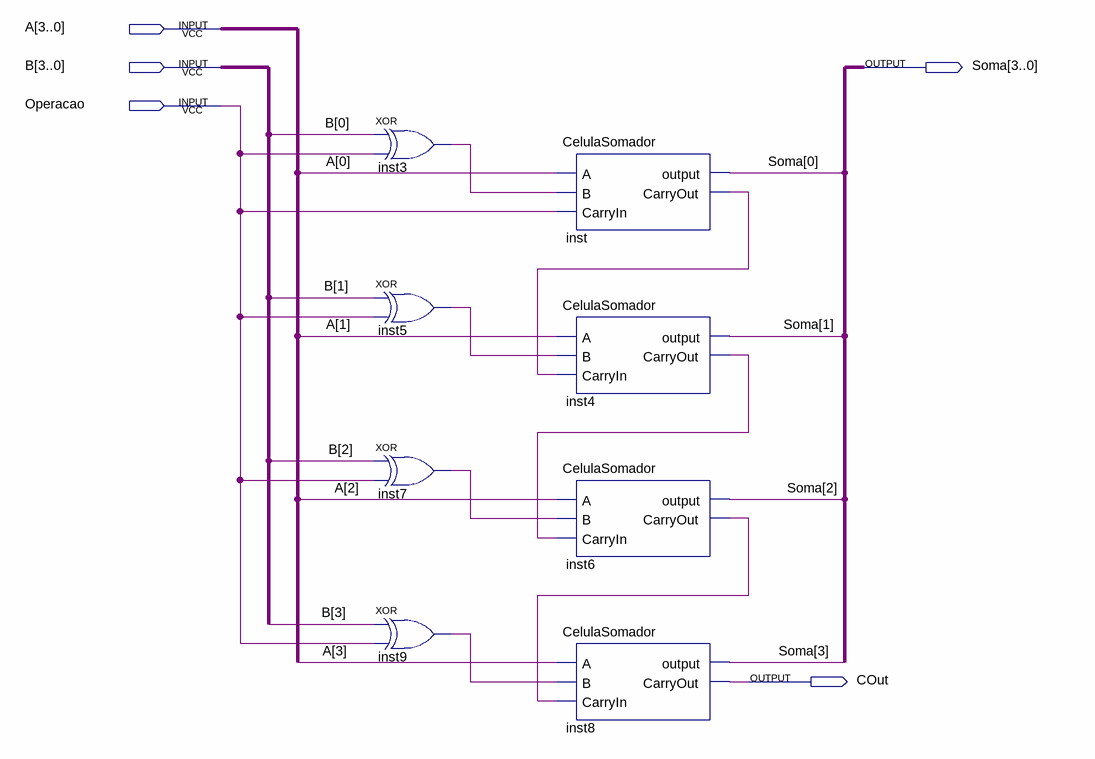
[diagram p0: schematic sheet]
// Quartus schematic SomaCompleto.bdf as structural Verilog: 8 symbols, 5 pins
module SomaCompleto (
  input  [3:0] A,
  input  [3:0] B,
  input  Operacao,
  output [3:0] Soma,
  output COut
);

  wire inst3_out, inst4_carryout, inst5_out, inst6_carryout, inst7_out, inst9_out, inst_carryout;

  xor inst3 (inst3_out, B[0], Operacao);
  xor inst5 (inst5_out, B[1], Operacao);
  xor inst7 (inst7_out, B[2], Operacao);
  xor inst9 (inst9_out, B[3], Operacao);
  CelulaSomador inst (.A(A[0]), .B(inst3_out), .CarryIn(Operacao), .\output (Soma[0]), .CarryOut(inst_carryout));
  CelulaSomador inst4 (.A(A[1]), .B(inst5_out), .CarryIn(inst_carryout), .\output (Soma[1]), .CarryOut(inst4_carryout));
  CelulaSomador inst6 (
    .A(A[2]), .B(inst7_out), .CarryIn(inst4_carryout), .\output (Soma[2]), .CarryOut(inst6_carryout));
  CelulaSomador inst8 (.A(A[3]), .B(inst9_out), .CarryIn(inst6_carryout), .\output (Soma[3]), .CarryOut(COut));
endmodule
